# EAGLE design Mega64 (EAGLE 4.13)
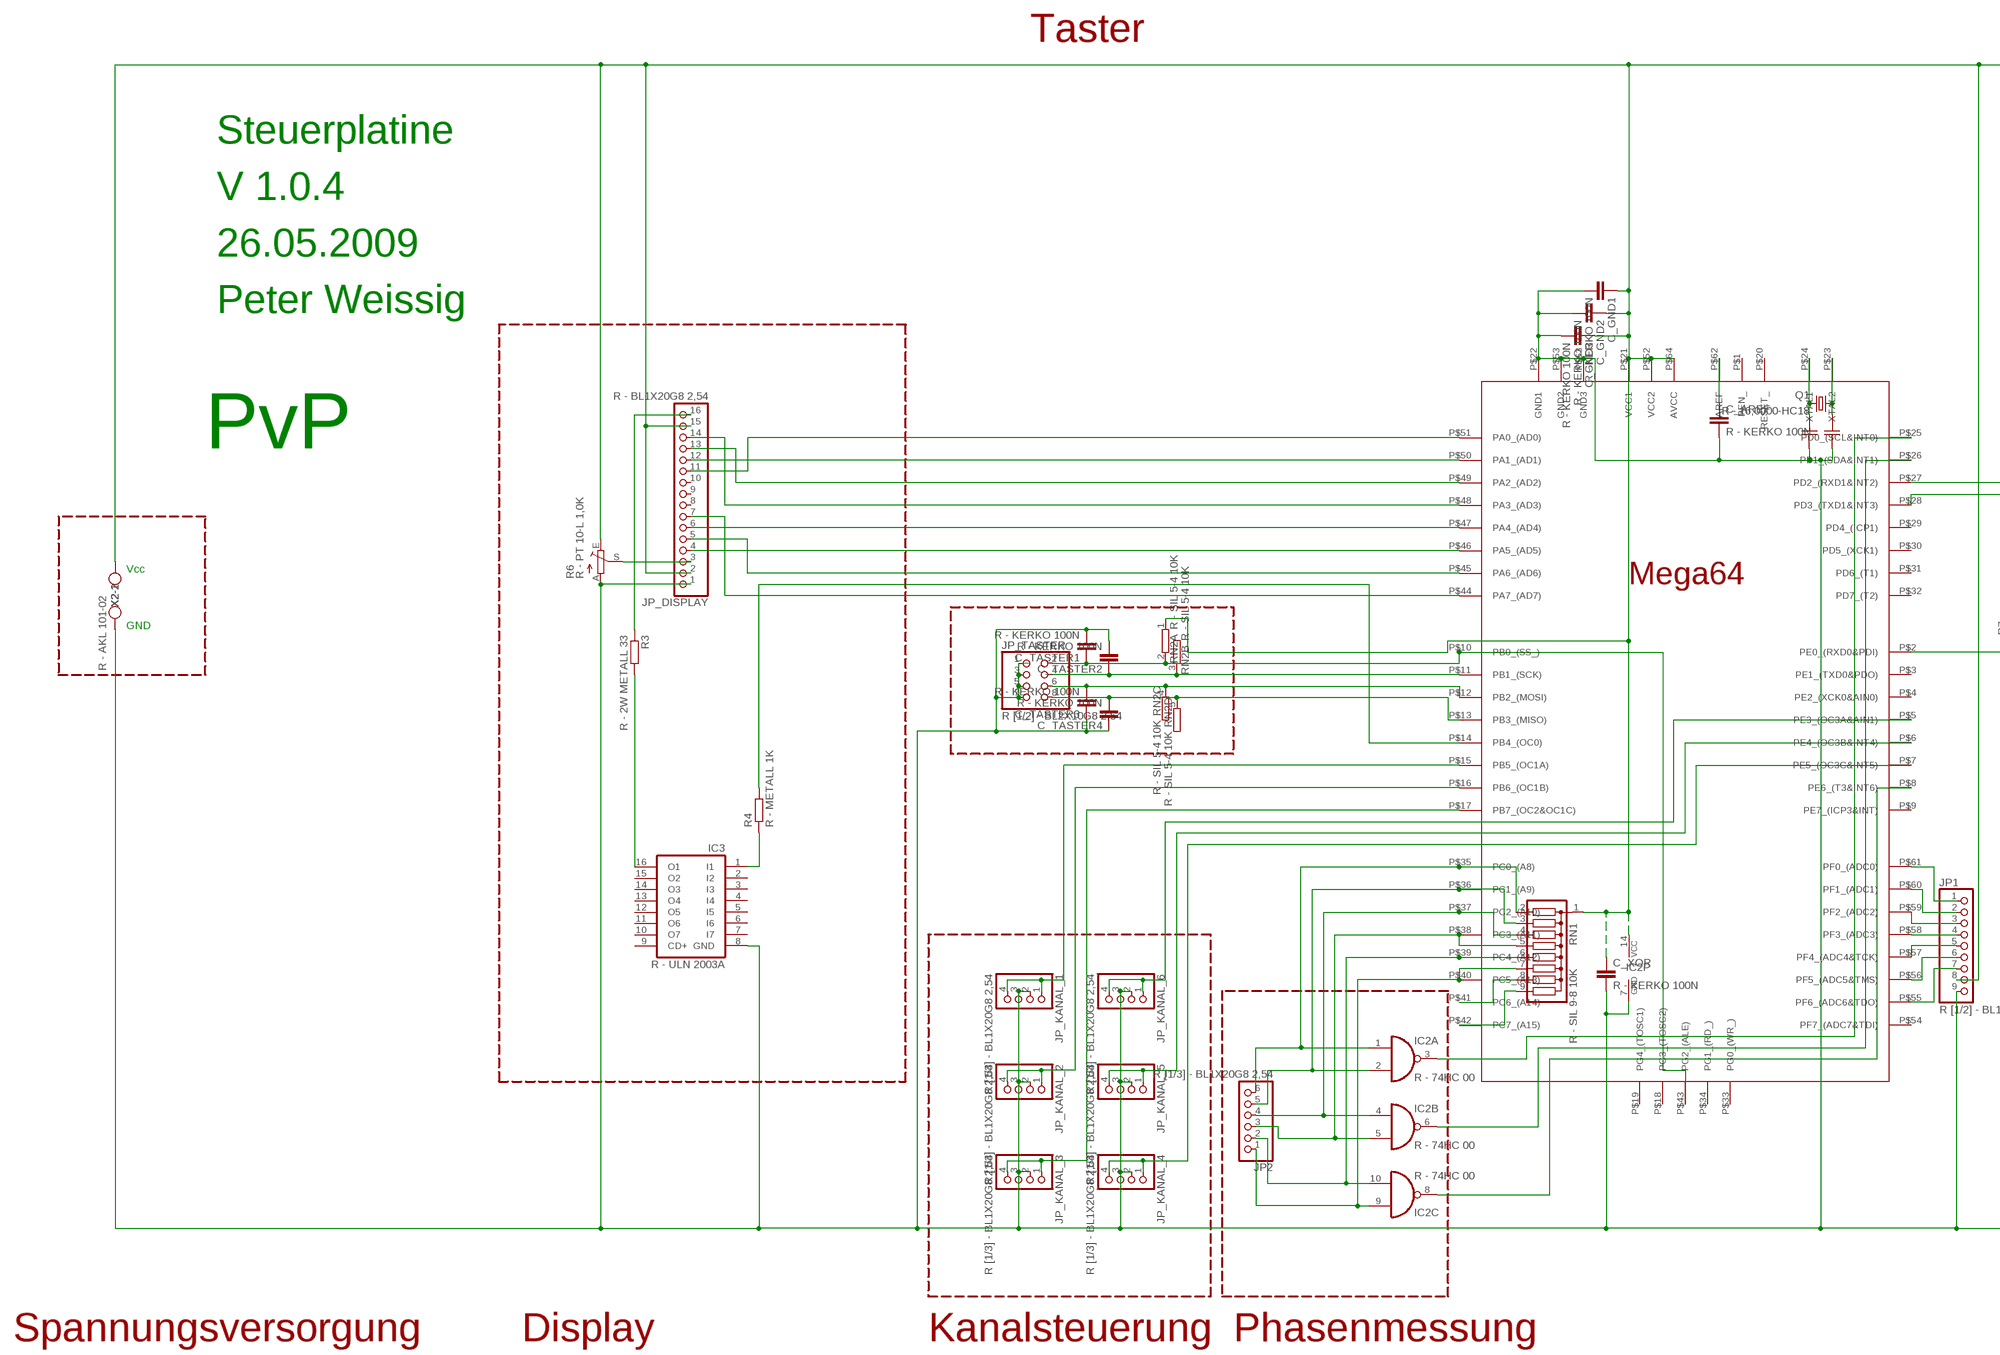
[diagram p0: schematic, sheet 1, part 1 of 2]
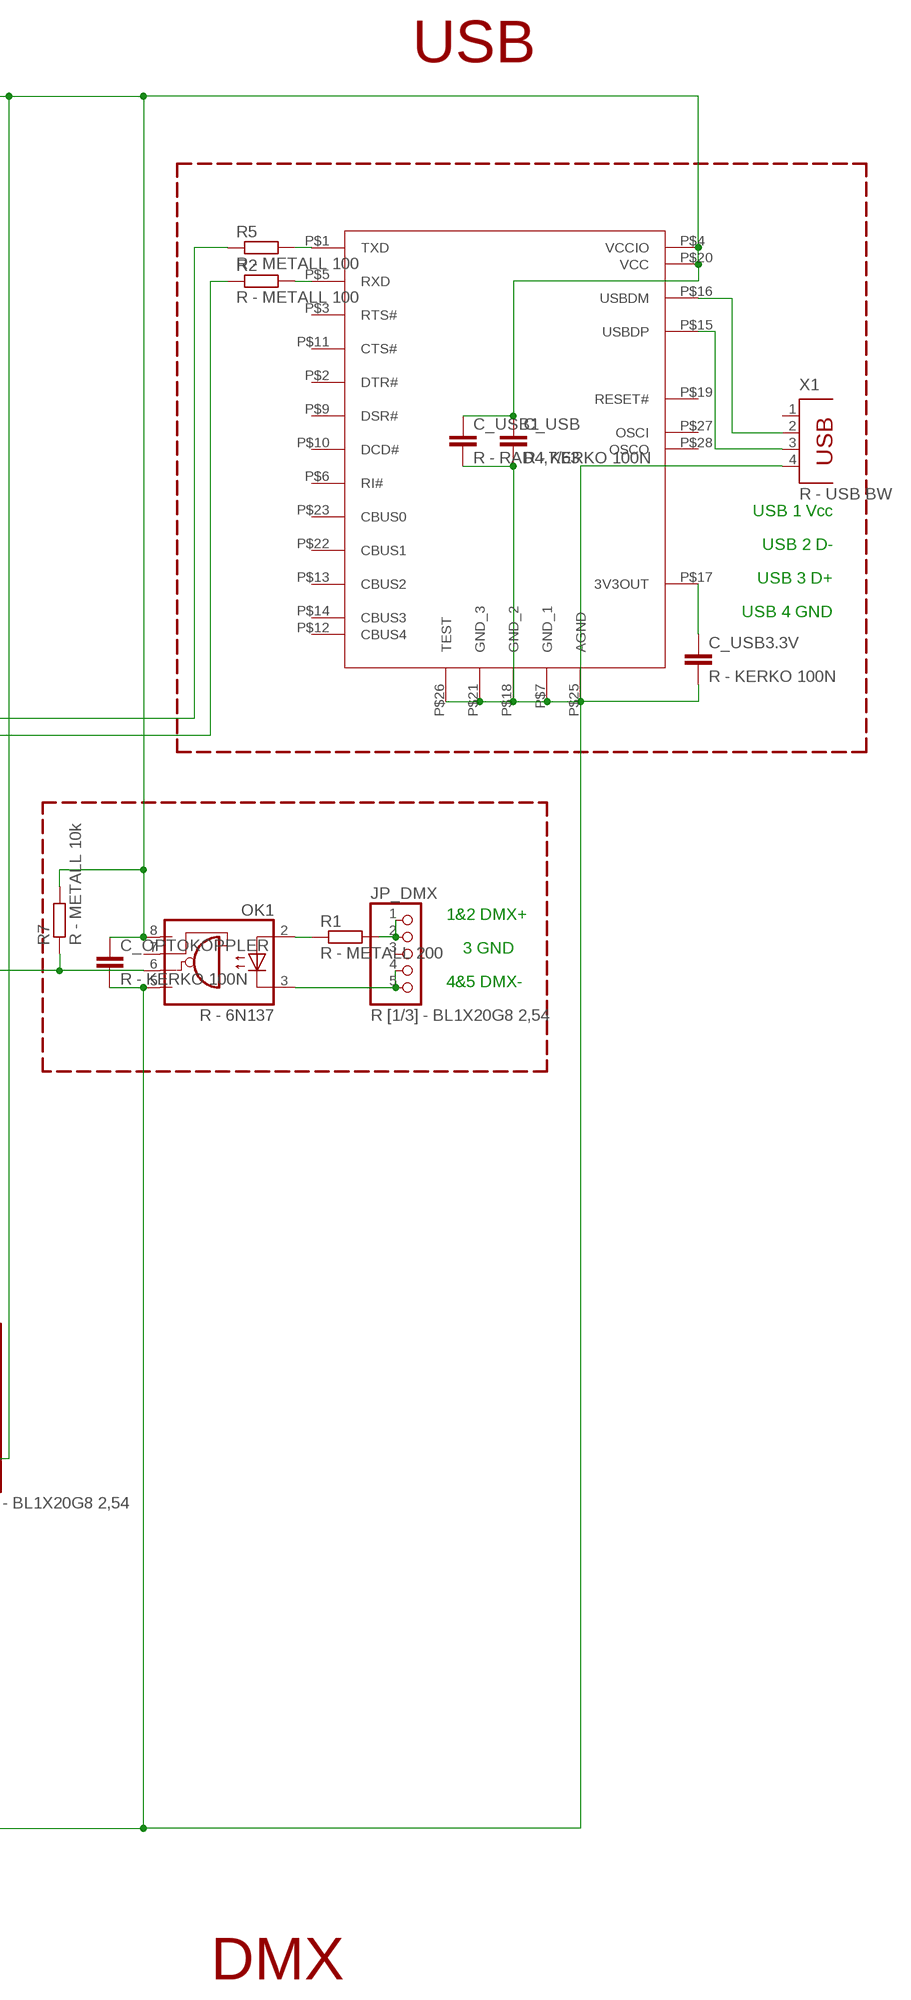
[diagram p1: schematic, sheet 1, part 2 of 2]

## Parts
C_AREF  R - KERKO 100N  C-EU025-025X050  [C025-025X050]
C_GND1  R - KERKO 100N  C-EU025-025X050  [C025-025X050]
C_GND2  R - KERKO 100N  C-EU025-025X050  [C025-025X050]
C_GND3  R - KERKO 100N  C-EU025-025X050  [C025-025X050]
C_OPTOKOPPLER  R - KERKO 100N  C-EU025-025X050  [C025-025X050]
C_TASTER1  R - KERKO 100N  C-EU050-025X075  [C050-025X075]
C_TASTER2  R - KERKO 100N  C-EU050-025X075  [C050-025X075]
C_TASTER3  R - KERKO 100N  C-EU050-025X075  [C050-025X075]
C_TASTER4  R - KERKO 100N  C-EU050-025X075  [C050-025X075]
C_USB  R - KERKO 100N  C-EU025-025X050  [C025-025X050]
C_USB1  R - RAD4,7/63  C-EU025-050X050  [C025-050X050]
C_USB3.3V  R - KERKO 100N  C-EU025-025X050  [C025-025X050]
C_XOR  R - KERKO 100N  C-EU025-025X050  [C025-025X050]
IC2  R - 74HC 00  74AC00N  [DIL14]
IC3  R - ULN 2003A  ULN2003AN  [DIL16]
JP1  R [1/2] - BL1X20G8 2,54  PINHD-1X9  [1X09]
JP2  R [1/3] - BL1X20G8 2,54  PINHD-1X6  [1X06]
JP_DISPLAY  R - BL1X20G8 2,54  PINHD-1X16  [1X16]
JP_DMX  R [1/3] - BL1X20G8 2,54  PINHD-1X5  [1X05]
JP_KANAL_1  R [1/3] - BL1X20G8 2,54  PINHD-1X4  [1X04]
JP_KANAL_2  R [1/3] - BL1X20G8 2,54  PINHD-1X4  [1X04]
JP_KANAL_3  R [1/3] - BL1X20G8 2,54  PINHD-1X4  [1X04]
JP_KANAL_4  R [1/3] - BL1X20G8 2,54  PINHD-1X4  [1X04]
JP_KANAL_5  R [1/3] - BL1X20G8 2,54  PINHD-1X4  [1X04]
JP_KANAL_6  R [1/3] - BL1X20G8 2,54  PINHD-1X4  [1X04]
JP_TASTER  R [1/2] - BL2X10G8 2,54  PINHD-2X4  [2X04]
OK1  R - 6N137  6N137  [DIL08]
Q1  R - 16,0000-HC18  CRYTALHC49U-H  [HC49U-H]
R1  R - METALL 200  R-EU_0207/10  [0207/10]
R2  R - METALL 100  R-EU_0207/10  [0207/10]
R3  R - 2W METALL 33  R-EU_0414/15  [0414/15]
R4  R - METALL 1K  R-EU_0207/10  [0207/10]
R5  R - METALL 100  R-EU_0207/10  [0207/10]
R6  R - PT 10-L 1,0K  TRIM_EU-LI10  [LI10]
R7  R - METALL 10k  R-EU_0207/10  [0207/10]
RN1  R - SIL 9-8 10K  G08R  [SIL9]
RN2  R - SIL 5-4 10K  GE04R  [SIL5]
U$1  R - ATMEGA 64-16TQ  MEGA64STECKFORM  [MEGA64_STECKFORM]
U$2  R - FT232RL  FT232RUNTEN  [SSOP28U]
U$3  R - NPO-G1206 22P  KONDENSATOR  [SMD1206]
U$4  R - NPO-G1206 22P  KONDENSATOR  [SMD1206]
X1  R - USB BW  PN61729  [PN61729]
X2  R - AKL 101-02  W237-102  [W237-102]

## Nets
AVCC: C_GND1.1 C_GND2.1 C_GND3.1 C_OPTOKOPPLER.1 C_USB1.1 C_USB.1 C_XOR.1 IC2.14(P:VCC) JP1.8 JP_DISPLAY.2 JP_DISPLAY.15 OK1.8(VCC) R6.E R7.2 RN1.1 RN2.1 U$1.P$21(VCC1) U$1.P$52(VCC2) U$1.P$64(AVCC) U$2.P$4(VCCIO) U$2.P$20(VCC) X2.1
GND: C_AREF.2 C_GND1.2 C_GND2.2 C_GND3.2 C_OPTOKOPPLER.2 C_TASTER1.2 C_TASTER2.2 C_TASTER3.1 C_TASTER4.1 C_USB1.2 C_USB3.3V.2 C_USB.2 C_XOR.2 IC2.7(P:GND) IC3.8(GND) JP1.9 JP_DISPLAY.1 JP_KANAL_1.2 JP_KANAL_1.3 JP_KANAL_2.2 JP_KANAL_2.3 JP_KANAL_3.2 JP_KANAL_3.3 JP_KANAL_4.2 JP_KANAL_4.3 JP_KANAL_5.2 JP_KANAL_5.3 JP_KANAL_6.2 JP_KANAL_6.3 JP_TASTER.1 JP_TASTER.3 JP_TASTER.5 JP_TASTER.7 OK1.5(GND) R6.A U$1.P$22(GND1) U$1.P$53(GND2) U$1.P$63(GND3) U$2.P$7(GND_1) U$2.P$18(GND_2) U$2.P$21(GND_3) U$2.P$25(AGND) U$2.P$26(TEST) U$3.P$2 U$4.P$2 X1.4 X2.2
N$1: Q1.2 U$1.P$24(XTAL1) U$3.P$1
N$2: Q1.1 U$1.P$23(XTAL2) U$4.P$1
N$3: IC2.3(A:O) U$1.P$25(PD0_(SCL&INT0))
N$4: IC2.2(A:I1) JP2.5 RN1.3 U$1.P$36(PC1_(A9))
N$5: IC2.1(A:I0) JP2.6 RN1.2 U$1.P$35(PC0_(A8))
N$6: IC2.4(B:I0) JP2.4 RN1.4 U$1.P$37(PC2_(A10))
N$7: IC2.5(B:I1) JP2.3 RN1.5 U$1.P$38(PC3_(A11))
N$8: IC2.9(C:I0) JP2.1 RN1.7 U$1.P$40(PC5_(A13))
N$9: OK1.6(VO) R7.1 U$1.P$2(PE0_(RXD0&PDI))
N$10: IC2.10(C:I1) JP2.2 RN1.6 U$1.P$39(PC4_(A12))
N$11: JP_KANAL_2.1 JP_KANAL_2.4 U$1.P$16(PB6_(OC1B))
N$12: JP_KANAL_3.1 JP_KANAL_3.4 U$1.P$17(PB7_(OC2&OC1C))
N$13: OK1.2(A) R1.1
N$14: JP_DMX.4 JP_DMX.5 OK1.3(C)
N$15: JP_KANAL_6.1 JP_KANAL_6.4 U$1.P$5(PE3_(OC3A&AIN1))
N$16: JP_KANAL_5.1 JP_KANAL_5.4 U$1.P$6(PE4_(OC3B&INT4))
N$17: JP_KANAL_4.1 JP_KANAL_4.4 U$1.P$7(PE5_(OC3C&INT5))
N$18: JP_DMX.1 JP_DMX.2 R1.2
N$19: JP_DISPLAY.5 U$1.P$45(PA6_(AD6))
N$20: JP_DISPLAY.4 U$1.P$46(PA5_(AD5))
N$21: JP_DISPLAY.6 U$1.P$47(PA4_(AD4))
N$22: JP_DISPLAY.14 U$1.P$48(PA3_(AD3))
N$23: JP_DISPLAY.13 U$1.P$49(PA2_(AD2))
N$24: JP_DISPLAY.12 U$1.P$50(PA1_(AD1))
N$25: JP_DISPLAY.11 U$1.P$51(PA0_(AD0))
N$26: JP_DISPLAY.16 R3.1
N$27: R4.2 U$1.P$14(PB4_(OC0))
N$28: JP_DISPLAY.3 R6.S
N$29: JP1.1 U$1.P$61(PF0_(ADC0))
N$30: IC2.6(B:O) U$1.P$26(PD1_(SDA&INT1))
N$31: JP1.2 U$1.P$60(PF1_(ADC1))
N$32: JP1.4 U$1.P$58(PF3_(ADC3))
N$33: JP1.3 U$1.P$59(PF2_(ADC2))
N$34: JP1.5 U$1.P$57(PF4_(ADC4&TCK))
N$35: JP1.6 U$1.P$56(PF5_(ADC5&TMS))
N$36: JP1.7 U$1.P$55(PF6_(ADC6&TDO))
N$37: U$2.P$16(USBDM) X1.2
N$38: U$2.P$15(USBDP) X1.3
N$39: C_TASTER1.1 JP_TASTER.2 RN2.2 U$1.P$10(PB0_(SS_)) U$1.P$43(PG2_(ALE))
N$41: IC3.16(O1) R3.2
N$42: IC2.8(C:O) U$1.P$8(PE6_(T3&INT6))
N$43: RN1.8 U$1.P$41(PC6_(A14))
N$44: JP_KANAL_1.1 JP_KANAL_1.4 U$1.P$15(PB5_(OC1A))
N$45: RN1.9 U$1.P$42(PC7_(A15))
N$46: IC3.1(I1) R4.1
N$47: R5.2 U$2.P$1(TXD)
N$48: R5.1 U$1.P$27(PD2_(RXD1&INT2))
N$49: R2.1 U$1.P$28(PD3_(TXD1&INT3))
N$50: C_TASTER3.2 JP_TASTER.6 RN2.4 U$1.P$12(PB2_(MOSI))
N$51: R2.2 U$2.P$5(RXD)
N$52: C_TASTER2.1 JP_TASTER.4 RN2.3 U$1.P$11(PB1_(SCK))
N$53: C_TASTER4.2 JP_TASTER.8 RN2.5 U$1.P$13(PB3_(MISO))
N$54: C_USB3.3V.1 U$2.P$17(3V3OUT)
N$55: JP_DISPLAY.7 U$1.P$44(PA7_(AD7))
N$63: C_AREF.1 U$1.P$62(AREF)
Unconnected: IC2.11(D:O) IC2.12(D:I0) IC2.13(D:I1) IC3.2(I2) IC3.3(I3) IC3.4(I4) IC3.5(I5) IC3.6(I6) IC3.7(I7) IC3.9(CD+) IC3.10(O7) IC3.11(O6) IC3.12(O5) IC3.13(O4) IC3.14(O3) IC3.15(O2) JP_DISPLAY.8 JP_DISPLAY.9 JP_DISPLAY.10 JP_DMX.3 OK1.7(VE) U$1.P$1(PEN_) U$1.P$3(PE1_(TXD0&PDO)) U$1.P$4(PE2_(XCK0&AIN0)) U$1.P$9(PE7_(ICP3&INT)) U$1.P$18(PG3_(TOSC2)) U$1.P$19(PG4_(TOSC1)) U$1.P$20(RESET_) U$1.P$29(PD4_(ICP1)) U$1.P$30(PD5_(XCK1)) U$1.P$31(PD6_(T1)) U$1.P$32(PD7_(T2)) U$1.P$33(PG0_(WR_)) U$1.P$34(PG1_(RD_)) U$1.P$54(PF7_(ADC7&TDI)) U$2.P$2(DTR#) U$2.P$3(RTS#) U$2.P$6(RI#) U$2.P$9(DSR#) U$2.P$10(DCD#) U$2.P$11(CTS#) U$2.P$12(CBUS4) U$2.P$13(CBUS2) U$2.P$14(CBUS3) U$2.P$19(RESET#) U$2.P$22(CBUS1) U$2.P$23(CBUS0) U$2.P$27(OSCI) U$2.P$28(OSCO) X1.1

## Notes on the sheet
- Taster | USB
- Steuerplatine
- V 1.0.4
- 26.05.2009
- Peter Weissig
- USB 1 Vcc
- USB 2 D-
- USB 3 D+
- USB 4 GND
- PvP
- Vcc
- 1&2 DMX+
- GND
- 3 GND
- 4&5 DMX-
- Spannungsversorgung | Display | Kanalsteuerung | Phasenmessung | DMX

## Library data of the parts
C_AREF C_GND1-C_GND3 C_OPTOKOPPLER C_TASTER1-C_TASTER4 C_USB C_USB1 C_USB3.3V C_XOR = rcl:C-EU: CAPACITOR, European symbol
IC2 = 74xx-eu:74*00: Quad 2-input NAND gate
IC3 = uln-udn:ULN2003A: DRIVER ARRAY
JP1 = pinhead:PINHD-1X9: PIN HEADER
JP2 = pinhead:PINHD-1X6: PIN HEADER
JP_DISPLAY = pinhead:PINHD-1X16: PIN HEADER
JP_DMX = pinhead:PINHD-1X5: PIN HEADER
JP_KANAL_1-JP_KANAL_6 = pinhead:PINHD-1X4: PIN HEADER
JP_TASTER = pinhead:PINHD-2X4: PIN HEADER
OK1 = optocoupler:6N137: MOTOROLA OPTO COUPLER
Q1 = crystal:CRYTAL: CRYSTAL
R1-R5 R7 = rcl:R-EU_: RESISTOR, European symbol
R6 = pot:TRIM_EU-: POTENTIOMETER
RN1 = resistor-sil:G08R: SIL RESISTOR
RN2 = resistor-sil:GE04R: SIL RESISTOR
U$1 = Meine eigene:MEGA64
U$2 = Meine eigene:FT232R
U$3 U$4 = Meine eigene:KONDENSATOR
X1 = con-berg:PN61729: BERG USB connector
X2 = con-wago-500:W237-102: WAGO SCREW CLAMP

## Board
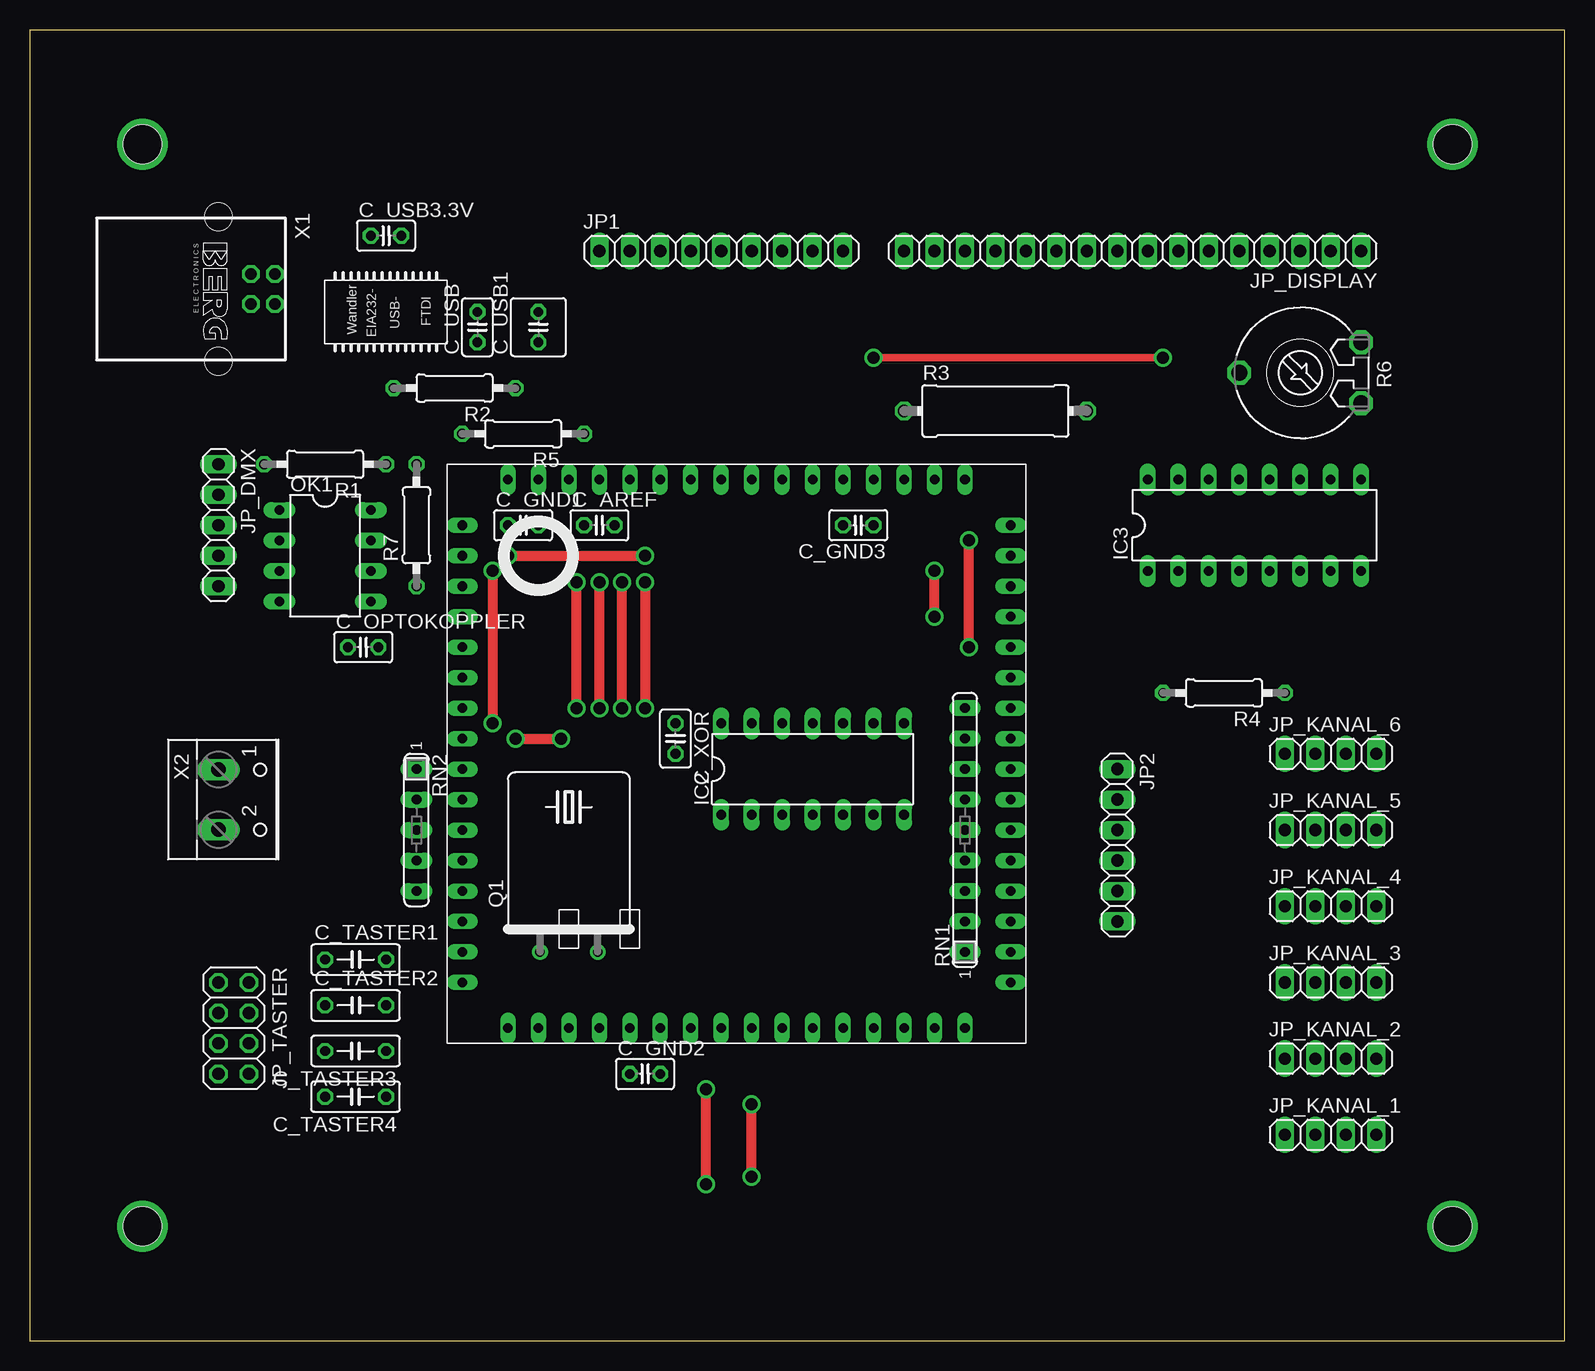
[diagram p2: board, top side]
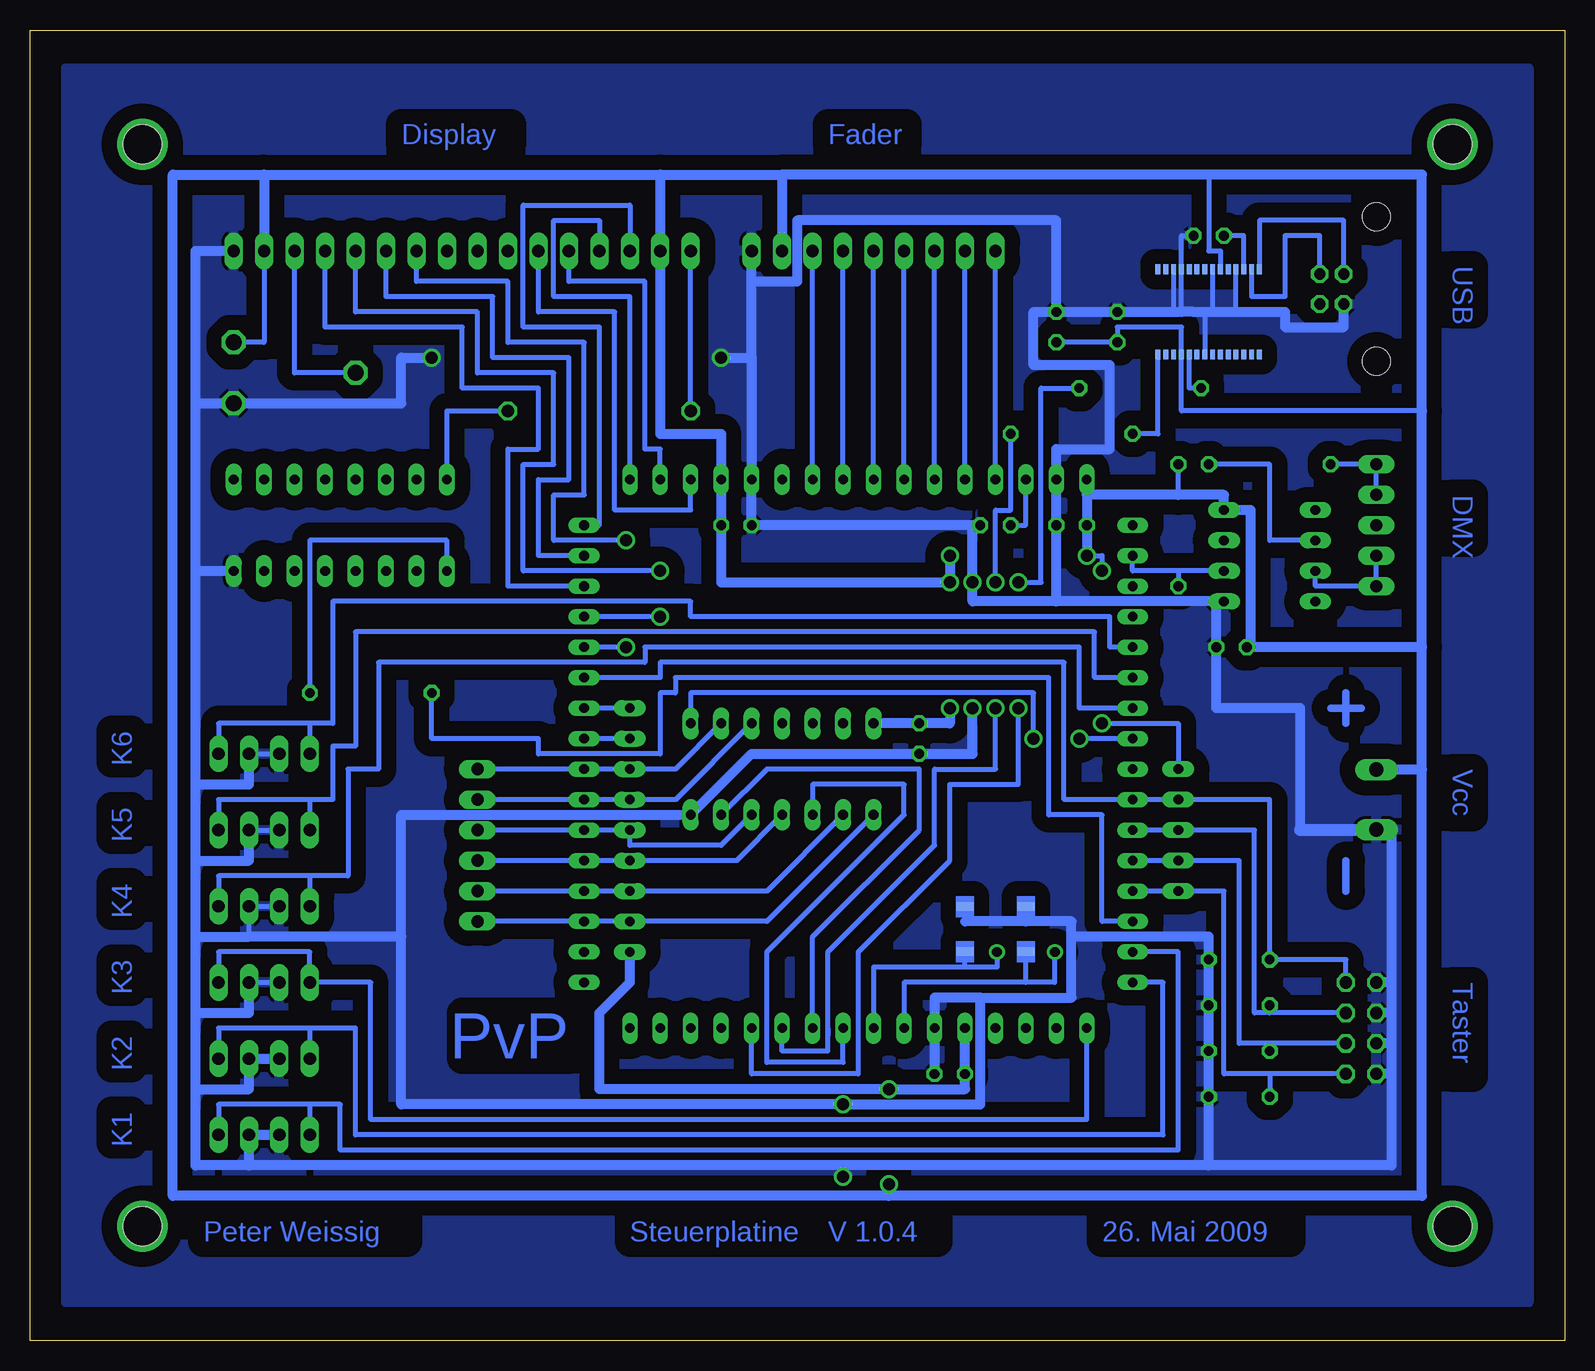
[diagram p3: board, bottom side, seen from below]

Size 127.94 x 109.21 mm. Coordinates in mm from the lower left corner, seen from the top.
Outline: 0,0 127.94,0 127.94,109.21 0,109.21 0,0
Copper layers (1*16): Top 0.035mm / dielectric 1.5mm / Bottom 0.035mm
Design rules "default": minimum track width 10mil, minimum drill 24mil, track to track 8mil, track to pad 8mil, pad to pad 8mil, via to via 8mil, smd to smd 8mil, copper to edge 40mil, drill to drill 8mil, minimum pad ring 10mil, minimum via ring 8mil, stop-mask expansion 4mil, vias tented up to drill 0mil, thermal gap 10mil
Holes 3.2 mm at 9.36,99.69 118.58,99.69 118.58,9.52 9.36,9.52

### Footprints (pad centres in the part's own frame; a part is rotated, then mirrored left to right if it is on the bottom)
C025-025X050 = drill 0.813 octagon: 1 -1.27,0; 2 1.27,0
C050-025X075 = drill 0.813 octagon: 1 -2.54,0; 2 2.54,0
C025-050X050 = drill 0.813 octagon: 1 -1.27,0; 2 1.27,0
DIL14 = drill 0.813 long: 1 -7.62,-3.81; 2 -5.08,-3.81; 3 -2.54,-3.81; 4 0,-3.81; 5 2.54,-3.81; 6 5.08,-3.81; 7 7.62,-3.81; 8 7.62,3.81; 9 5.08,3.81; 10 2.54,3.81; 11 0,3.81; 12 -2.54,3.81; 13 -5.08,3.81; 14 -7.62,3.81
DIL16 = drill 0.813 long: 1 -8.89,-3.81; 2 -6.35,-3.81; 3 -3.81,-3.81; 4 -1.27,-3.81; 5 1.27,-3.81; 6 3.81,-3.81; 7 6.35,-3.81; 8 8.89,-3.81; 9 8.89,3.81; 10 6.35,3.81; 11 3.81,3.81; 12 1.27,3.81; 13 -1.27,3.81; 14 -3.81,3.81; 15 -6.35,3.81; 16 -8.89,3.81
1X09 = drill 1.016 long: 1 -10.16,0; 2 -7.62,0; 3 -5.08,0; 4 -2.54,0; 5 0,0; 6 2.54,0; 7 5.08,0; 8 7.62,0; 9 10.16,0
1X06 = drill 1.016 long: 1 -6.35,0; 2 -3.81,0; 3 -1.27,0; 4 1.27,0; 5 3.81,0; 6 6.35,0
1X16 = drill 1.016 long: 1 -19.05,0; 2 -16.51,0; 3 -13.97,0; 4 -11.43,0; 5 -8.89,0; 6 -6.35,0; 7 -3.81,0; 8 -1.27,0; 9 1.27,0; 10 3.81,0; 11 6.35,0; 12 8.89,0; 13 11.43,0; 14 13.97,0; 15 16.51,0; 16 19.05,0
1X05 = drill 1.016 long: 1 -5.08,0; 2 -2.54,0; 3 0,0; 4 2.54,0; 5 5.08,0
1X04 = drill 1.016 long: 1 -3.81,0; 2 -1.27,0; 3 1.27,0; 4 3.81,0
2X04 = drill 1.016 octagon: 1 -3.81,-1.27; 2 -3.81,1.27; 3 -1.27,-1.27; 4 -1.27,1.27; 5 1.27,-1.27; 6 1.27,1.27; 7 3.81,-1.27; 8 3.81,1.27
DIL08 = drill 0.813 long: 1 -3.81,-3.81; 2 -1.27,-3.81; 3 1.27,-3.81; 4 3.81,-3.81; 5 3.81,3.81; 6 1.27,3.81; 7 -1.27,3.81; 8 -3.81,3.81
HC49U-H = drill 0.813 round: 1 -2.413,-5.08; 2 2.413,-5.08
0207/10 = drill 0.813 octagon: 1 -5.08,0; 2 5.08,0
0414/15 = drill 1.016 octagon: 1 -7.62,0; 2 7.62,0
LI10 = drill 1.321 octagon: A -2.54,-5.08; E 2.54,-5.08; S 0,5.08
SIL9 = drill 0.813 long: 1 -10.16,0; 2 -7.62,0; 3 -5.08,0; 4 -2.54,0; 5 0,0; 6 2.54,0; 7 5.08,0; 8 7.62,0; 9 10.16,0
SIL5 = drill 0.813 long: 1 -5.08,0; 2 -2.54,0; 3 0,0; 4 2.54,0; 5 5.08,0
MEGA64_STECKFORM = drill 0.8 long: P$1 -22.86,19.05; P$2 -22.86,16.51; P$3 -22.86,13.97; P$4 -22.86,11.43; P$5 -22.86,8.89; P$6 -22.86,6.35; P$7 -22.86,3.81; P$8 -22.86,1.27; P$9 -22.86,-1.27; P$10 -22.86,-3.81; P$11 -22.86,-6.35; P$12 -22.86,-8.89; P$13 -22.86,-11.43; P$14 -22.86,-13.97; P$15 -22.86,-16.51; P$16 -22.86,-19.05; P$17 -19.05,-22.86; P$18 -16.51,-22.86; P$19 -13.97,-22.86; P$20 -11.43,-22.86; P$21 -8.89,-22.86; P$22 -6.35,-22.86; P$23 -3.81,-22.86; P$24 -1.27,-22.86; P$25 1.27,-22.86; P$26 3.81,-22.86; P$27 6.35,-22.86; P$28 8.89,-22.86; P$29 11.43,-22.86; P$30 13.97,-22.86; P$31 16.51,-22.86; P$32 19.05,-22.86; P$33 22.86,-19.05; P$34 22.86,-16.51; P$35 22.86,-13.97; P$36 22.86,-11.43; P$37 22.86,-8.89; P$38 22.86,-6.35; P$39 22.86,-3.81; P$40 22.86,-1.27; P$41 22.86,1.27; P$42 22.86,3.81; P$43 22.86,6.35; P$44 22.86,8.89; P$45 22.86,11.43; P$46 22.86,13.97; P$47 22.86,16.51; P$48 22.86,19.05; P$49 19.05,22.86; P$50 16.51,22.86; P$51 13.97,22.86; P$52 11.43,22.86; P$53 8.89,22.86; P$54 6.35,22.86; P$55 3.81,22.86; P$56 1.27,22.86; P$57 -1.27,22.86; P$58 -3.81,22.86; P$59 -6.35,22.86; P$60 -8.89,22.86; P$61 -11.43,22.86; P$62 -13.97,22.86; P$63 -16.51,22.86; P$64 -19.05,22.86
SSOP28U = smd 0.813 x 0.406 bottom: P$1 3.55,4.225; P$2 3.55,3.575; P$3 3.55,2.925; P$4 3.55,2.275; P$5 3.55,1.625; P$6 3.55,0.975; P$7 3.55,0.325; P$8 3.55,-0.325; P$9 3.55,-0.975; P$10 3.55,-1.625; P$11 3.55,-2.275; P$12 3.55,-2.925; P$13 3.55,-3.575; P$14 3.55,-4.225; P$15 -3.55,-4.225; P$16 -3.55,-3.575; P$17 -3.55,-2.925; P$18 -3.55,-2.275; P$19 -3.55,-1.625; P$20 -3.55,-0.975; P$21 -3.55,-0.325; P$22 -3.55,0.325; P$23 -3.55,0.975; P$24 -3.55,1.625; P$25 -3.55,2.275; P$26 -3.55,2.925; P$27 -3.55,3.575; P$28 -3.55,4.225
SMD1206 = smd 1.422 x 0.711 bottom: P$1 0,-1.875; P$2 0,1.875
PN61729 = drill 0.95 octagon: 1 1.25,4.71; 2 -1.25,4.71; 3 -1.25,2.71; 4 1.25,2.71 | hole 2.3: -6.02,0; 6.02,0
W237-102 = drill 1.194 long: 1 -2.5,-1.27; 2 2.5,-1.27

### Placement (x,y rotation side)
C_AREF  47.46,67.94 0 top
C_GND1  41.11,67.94 0 top
C_GND2  51.27,22.22 0 top
C_GND3  69.05,67.94 180 top
C_OPTOKOPPLER  27.77,57.78 0 top
C_TASTER1  27.14,31.74 0 top
C_TASTER2  27.14,27.93 0 top
C_TASTER3  27.14,24.12 180 top
C_TASTER4  27.14,20.31 180 top
C_USB  37.3,84.45 90 top
C_USB1  42.38,84.45 90 top
C_USB3.3V  29.68,92.07 0 top
C_XOR  53.81,50.16 270 top
IC2  65.24,47.62 0 top
IC3  102.07,67.94 0 top
JP1  57.62,90.8 0 top
JP2  90.64,41.27 270 top
JP_DISPLAY  91.91,90.8 180 top
JP_DMX  15.71,67.94 270 top
JP_KANAL_1  108.42,17.14 0 top
JP_KANAL_2  108.42,23.49 0 top
JP_KANAL_3  108.42,29.84 0 top
JP_KANAL_4  108.42,36.19 0 top
JP_KANAL_5  108.42,42.54 0 top
JP_KANAL_6  108.42,48.89 0 top
JP_TASTER  16.98,26.03 270 top
OK1  24.6,65.4 270 top
Q1  44.92,37.46 0 top
R1  24.6,73.02 180 top
R2  35.39,79.37 180 top
R3  80.48,77.47 0 top
R4  99.53,53.97 180 top
R5  41.11,75.56 180 top
R6  105.88,80.64 90 top
R7  32.22,67.94 90 top
RN1  77.94,42.54 90 top
RN2  32.22,42.54 270 top
U$1  58.89,48.89 0 top
U$2  29.68,85.72 270 top
U$3  50,34.28 0 top
U$4  44.92,34.28 0 top
X1  15.71,87.62 270 top
X2  16.98,45.08 270 top

### Tracks (layer width: path | path; a pad name or v marks a point on that pad's centre or on a via)
AVCC  (via drill 1)
  Top 0.813: v51.27,63.18 v51.27,52.7 | v39.84,65.4 v51.27,65.4 | v56.35,13.01 v56.35,20.95 | v38.57,64.13 v38.57,51.43
  Bottom 0.406: JP_DISPLAY.2 108.42,83.18 R6.E | C_USB1.1 C_USB.1 37.3,84.45 31.95,84.45 U$2.P$4 31.95,77.47 11.9,77.47 | U$2.P$20 28.7,90.8 29.68,90.8 29.68,97.15 | RN2.1 32.22,51.43 v38.57,51.43 | v38.57,64.13 38.57,65.4 v39.84,65.4 | 32.22,70.48 R7.2
  Bottom 0.813: 26.19,57.78 26.19,69.21 OK1.8 28.41,70.48 32.22,70.48 39.84,70.48 | U$1.P$21 C_GND2.1 50,20.95 v56.35,20.95 80.48,20.95 80.48,27.3 77.94,29.84 RN1.1 | 39.84,70.48 C_GND1.1 v39.84,65.4 | 39.84,70.48 U$1.P$64 | IC2.14 C_XOR.1 51.27,51.43 v51.27,52.7 | v51.27,65.4 v51.27,63.18 70.32,63.18 C_GND3.1 U$1.P$52 70.32,75.56 75.4,75.56 JP_DISPLAY.15 75.4,97.15 | 108.42,97.15 116.04,97.15 116.04,12.06 56.35,12.06 | 108.42,97.15 75.4,97.15 | 65.24,97.15 29.68,97.15 11.9,97.15 11.9,77.47 11.9,57.78 | 75.4,97.15 65.24,97.15 | 11.9,57.78 26.19,57.78 | 26.19,57.78 C_OPTOKOPPLER.1 | 108.42,97.15 JP_DISPLAY.2 | 65.24,97.15 JP1.8 | 11.9,47.58 X2.1 | 11.9,47.58 11.9,57.78 | 11.9,47.58 11.9,12.06 56.35,12.06 | 56.35,12.06 v56.35,13.01
GND  (via drill 1)
  Top 0.61: v94.45,81.91 v70.32,81.91
  Top 0.813: v49.36,52.7 v49.36,63.18 | v60.16,13.65 v60.16,19.68
  Bottom 0.406: JP_KANAL_6.3 JP_KANAL_6.2 | JP_KANAL_5.3 JP_KANAL_5.2 | JP_KANAL_4.2 JP_KANAL_4.3 109.69,33.65 | JP_KANAL_3.3 JP_KANAL_3.2 | U$2.P$7 30,85.72 29.68,85.72 29.35,85.72 U$2.P$21 | U$2.P$26 32.6,85.72 32.22,85.72 30.95,85.72 | 31.95,85.72 U$2.P$25 31.95,92.07 C_USB3.3V.2 | U$2.P$18 27.41,85.72 28.41,85.72 | 44.92,34.92 U$4.P$2 | 50,34.92 U$3.P$2 | 50,67.94 C_AREF.2
  Bottom 0.813: 29.05,61.59 C_OPTOKOPPLER.2 29.05,52.7 22.06,52.7 22.06,42.54 | C_GND2.2 U$1.P$22 52.54,28.57 48.73,28.57 | X1.4 18.42,84.45 23.33,84.45 23.33,85.72 28.41,85.72 29.68,85.72 30.95,85.72 31.95,85.72 | 67.78,88.26 JP1.9 | JP_KANAL_1.2 JP_KANAL_1.3 109.69,14.6 | JP_KANAL_2.2 JP_KANAL_2.3 109.69,20.95 114.13,20.95 | 29.05,61.59 OK1.5 | 29.05,61.59 42.38,61.59 | 42.38,61.59 C_GND1.2 U$1.P$63 42.38,74.29 37.94,74.29 37.94,81.28 44.28,81.28 44.28,85.72 C_USB1.2 | JP_KANAL_5.3 109.69,40 114.13,40 | JP_KANAL_6.3 109.69,46.35 114.13,46.35 | JP_KANAL_3.3 109.69,27.3 114.13,27.3 | 114.13,20.95 114.13,14.6 109.69,14.6 | 114.13,20.95 114.13,27.3 | 114.13,27.3 114.13,33.65 | 114.13,33.65 114.13,40 | 114.13,40 114.13,46.35 | 114.13,33.65 109.69,33.65 96.99,33.65 | 96.99,33.65 96.99,43.81 IC2.7 67.78,48.89 C_XOR.2 49.36,48.89 v49.36,52.7 | 48.73,28.57 48.73,19.68 v60.16,19.68 96.99,19.68 96.99,33.65 | 48.73,28.57 41.11,28.57 41.11,33.65 | 41.11,33.65 41.11,34.92 44.92,34.92 50,34.92 | 42.38,61.59 49.36,61.59 v49.36,63.18 49.36,67.94 50,67.94 C_GND3.2 U$1.P$53 67.78,81.91 | 29.68,14.6 14.44,14.6 14.44,22.22 | 14.44,22.22 14.44,24.76 | 14.44,24.76 14.44,27.3 | 14.44,27.3 14.44,29.84 | 14.44,29.84 14.44,42.54 | 14.44,29.84 JP_TASTER.1 | 14.44,27.3 JP_TASTER.3 | 14.44,24.76 JP_TASTER.5 | 14.44,22.22 JP_TASTER.7 | 29.68,14.6 C_TASTER4.1 C_TASTER3.1 C_TASTER2.2 C_TASTER1.2 29.68,33.65 41.11,33.65 | C_USB1.2 C_USB.2 32.22,85.72 | C_USB1.2 42.38,93.34 63.97,93.34 63.97,88.26 67.78,88.26 | v94.45,81.91 96.99,81.91 96.99,78.1 R6.A 114.13,78.1 | 67.78,81.91 67.78,88.26 | v70.32,81.91 67.78,81.91 | 114.13,46.35 114.13,64.13
  Bottom 0.813: 114.13,64.13 IC3.8 | 114.13,64.13 114.13,78.1 | 114.13,78.1 114.13,90.8 JP_DISPLAY.1 | 29.68,14.6 60.16,14.6 | 60.16,14.6 109.69,14.6 | 60.16,14.6 v60.16,13.65
  Bottom 1.016: 14.44,42.54 22.06,42.54
  pour Bottom (isolate 1.27): 3.01,106.04 3.01,3.17 124.93,3.17 124.93,106.04
N$1
  Bottom 0.406: Q1.2 47.33,31.11 50,31.11 | 50,31.11 57.62,31.11 U$1.P$24 | U$3.P$1 50,32.38 50,31.11
N$2
  Bottom 0.406: Q1.1 42.51,29.84 44.92,29.84 | 44.92,29.84 55.08,29.84 U$1.P$23 | U$4.P$1 44.92,32.38 44.92,31.11 44.92,29.84
N$3
  Bottom 0.406: IC2.3 62.7,46.35 55.08,46.35 55.08,43.81 66.51,32.38 66.51,23.17 60.16,23.17 U$1.P$25
N$4
  Bottom 0.406: IC2.2 66.51,37.46 RN1.3 U$1.P$36 88.1,37.46 JP2.5
N$5
  Bottom 0.406: IC2.1 66.51,34.92 RN1.2 U$1.P$35 JP2.6
N$6
  Bottom 0.406: IC2.4 69.05,40 RN1.4 U$1.P$37 JP2.4
N$7
  Bottom 0.406: IC2.5 70.32,41.27 77.94,41.27 RN1.5 U$1.P$38 JP2.3
N$8
  Bottom 0.406: IC2.9 74.13,47.62 RN1.7 U$1.P$40 88.1,47.62 JP2.1
N$9
  Bottom 0.406: 32.22,64.13 36.03,64.13 U$1.P$2 | OK1.6 32.22,64.13 | 32.22,64.13 R7.1
N$10
  Bottom 0.406: IC2.10 74.13,45.08 RN1.6 U$1.P$39 JP2.2
N$11
  Bottom 0.406: JP_KANAL_2.4 112.23,26.03 104.61,26.03 | 104.61,26.03 JP_KANAL_2.1 | 104.61,26.03 100.8,26.03 100.8,17.14 33.49,17.14 33.49,29.84 U$1.P$16
N$12
  Bottom 0.406: JP_KANAL_3.4 112.23,32.38 104.61,32.38 JP_KANAL_3.1 99.53,29.84 99.53,18.41 39.84,18.41 U$1.P$17
N$13
  Bottom 0.406: R1.1 24.6,73.02 24.6,66.67 OK1.2
N$14
  Bottom 0.406: JP_DMX.4 JP_DMX.5 20.79,62.86 OK1.3
N$15
  Bottom 0.406: U$1.P$5 37.94,57.78 37.94,60.32 72.86,60.32 72.86,61.59 102.7,61.59 102.7,51.43 104.61,51.43 | JP_KANAL_6.4 112.23,51.43 104.61,51.43 | 104.61,51.43 JP_KANAL_6.1
N$16
  Bottom 0.406: JP_KANAL_5.4 112.23,45.08 104.61,45.08 | 104.61,45.08 JP_KANAL_5.1 | U$1.P$6 39.2,55.24 39.2,59.05 100.8,59.05 100.8,49.52 102.7,49.52 102.7,45.08 104.61,45.08
N$17
  Bottom 0.406: JP_KANAL_4.4 112.23,38.73 104.61,38.73 | 104.61,38.73 JP_KANAL_4.1 | 104.61,38.73 101.44,38.73 101.44,47.62 98.89,47.62 98.89,56.51 76.67,56.51 76.67,57.78 40.48,57.78 40.48,52.7 U$1.P$7
N$18
  Bottom 0.406: JP_DMX.2 JP_DMX.1 R1.2
N$19  (via drill 1)
  Top 0.813: v75.4,60.32 v75.4,64.13
  Bottom 0.406: v75.4,60.32 U$1.P$45 | v75.4,64.13 86.83,64.13 86.83,73.02 84.29,73.02 84.29,80.64 90.64,80.64 90.64,85.72 100.8,85.72 JP_DISPLAY.5
N$20
  Bottom 0.406: U$1.P$46 88.1,62.86 88.1,74.29 85.56,74.29 85.56,79.37 91.91,79.37 91.91,84.45 103.34,84.45 JP_DISPLAY.4
N$21
  Bottom 0.406: U$1.P$47 85.56,65.4 85.56,71.75 83.02,71.75 83.02,81.91 89.37,81.91 89.37,86.99 98.26,86.99 JP_DISPLAY.6
N$22
  Bottom 0.406: JP_DISPLAY.14 77.94,94.61 86.83,94.61 86.83,84.45 80.48,84.45 80.48,67.94 U$1.P$48
N$23
  Bottom 0.406: U$1.P$49 77.94,86.99 84.29,86.99 84.29,93.34 80.48,93.34 JP_DISPLAY.13
N$24
  Bottom 0.406: U$1.P$50 75.4,74.29 76.67,74.29 76.67,88.26 83.02,88.26 JP_DISPLAY.12
N$25
  Bottom 0.406: U$1.P$51 72.86,69.21 79.21,69.21 79.21,85.72 85.56,85.72 JP_DISPLAY.11
N$26
  Bottom 0.406: R3.1 JP_DISPLAY.16
N$27
  Bottom 0.406: R4.2 94.45,50.16 85.56,50.16 85.56,48.89 75.4,48.89 75.4,53.97 74.13,53.97 74.13,55.24 43.02,55.24 43.02,43.81 38.57,43.81 38.57,34.92 U$1.P$14
N$28
  Bottom 0.406: JP_DISPLAY.3 105.88,80.64 R6.S
N$29
  Bottom 0.406: U$1.P$61 JP1.1
N$30
  Bottom 0.406: IC2.6 66.51,47.62 53.81,47.62 53.81,42.54 62.7,33.65 U$1.P$26
N$31
  Bottom 0.406: U$1.P$60 JP1.2
N$32
  Bottom 0.406: U$1.P$58 JP1.4
N$33
  Bottom 0.406: U$1.P$59 JP1.3
N$34
  Bottom 0.406: U$1.P$57 JP1.5
N$35
  Bottom 0.406: U$1.P$56 JP1.6
N$36
  Bottom 0.406: U$1.P$55 JP1.7
N$37
  Bottom 0.406: X1.2 20.42,92.07 23.33,92.07 23.33,86.99 26.1,86.99 U$2.P$16
N$38
  Bottom 0.406: X1.3 18.42,93.34 25.45,93.34 U$2.P$15
N$39
  Bottom 0.406: JP_TASTER.2 18.25,31.74 C_TASTER1.1 24.6,45.08 RN2.2 U$1.P$10 41.74,45.08 41.74,56.51 75.4,56.51 75.4,55.24 U$1.P$43
N$41
  Bottom 0.406: R3.2 93.18,77.47 IC3.16
N$42  (via drill 1)
  Top 0.813: v40.48,50.16 v44.28,50.16
  Bottom 0.406: IC2.8 72.86,53.97 44.28,53.97 v44.28,50.16 | U$1.P$8 v40.48,50.16
N$43
  Bottom 0.406: RN1.8 U$1.P$41
N$44
  Bottom 0.406: JP_KANAL_1.4 112.23,19.68 104.61,19.68 | 104.61,19.68 JP_KANAL_1.1 | 104.61,19.68 102.07,19.68 102.07,15.87 32.22,15.87 32.22,32.38 U$1.P$15
N$45
  Bottom 0.406: RN1.9 U$1.P$42
N$46
  Bottom 0.406: IC3.1 93.18,66.67 104.61,66.67 R4.1
N$47
  Bottom 0.406: U$2.P$1 33.91,75.56 R5.2
N$48  (via drill 1)
  Top 0.813: v47.46,52.7 v47.46,63.18
  Bottom 0.406: v47.46,63.18 47.46,69.21 46.19,69.21 R5.1 | v47.46,52.7 47.46,47.62 52.54,47.62 52.54,41.27 61.43,32.38 61.43,26.03 | 61.43,26.03 61.43,25.39 | U$1.P$27 65.24,24.12 61.43,24.12 61.43,26.03
N$49  (via drill 1)
  Top 0.813: v45.55,52.7 v45.55,63.18
  Bottom 0.406: v45.55,52.7 45.55,46.35 51.27,46.35 51.27,40 58.89,32.38 58.89,22.22 67.78,22.22 U$1.P$28 | v45.55,63.18 43.65,63.18 43.65,79.37 R2.1
N$50
  Bottom 0.406: JP_TASTER.6 24.6,24.76 | 24.6,24.76 C_TASTER3.2 | 24.6,24.76 27.14,24.76 27.14,40 RN2.4 U$1.P$12
N$51
  Bottom 0.406: U$2.P$5 31.3,79.37 R2.2
N$52
  Bottom 0.406: JP_TASTER.4 24.6,27.3 | 24.6,27.3 C_TASTER2.1 | 24.6,27.3 25.87,27.3 25.87,42.54 RN2.3 U$1.P$11
N$53
  Bottom 0.406: JP_TASTER.8 24.6,22.22 | 24.6,22.22 C_TASTER4.2 | 24.6,22.22 28.41,22.22 28.41,37.46 30.95,37.46 RN2.5 U$1.P$13
N$54
  Bottom 0.406: U$2.P$17 26.75,92.07 C_USB3.3V.1
N$55  (via drill 1)
  Top 0.813: v78.26,57.78 v78.26,66.67
  Bottom 0.406: JP_DISPLAY.7 95.72,88.26 88.1,88.26 88.1,83.18 81.75,83.18 81.75,70.48 84.29,70.48 84.29,66.67 v78.26,66.67 | v78.26,57.78 U$1.P$44
N$56
  Bottom 0.61: 16.98,52.7 19.52,52.7
N$57
  Bottom 0.61: 18.25,51.43 18.25,53.97
N$58
  Bottom 0.61: 18.25,37.46 18.25,40
N$59  (via drill 3.2)
  other vias: 118.58,99.69
N$60  (via drill 3.2)
  other vias: 118.58,9.52
N$61  (via drill 3.2)
  other vias: 9.36,9.52
N$62  (via drill 3.2)
  other vias: 9.36,99.69
N$63
  Bottom 0.406: U$1.P$62 44.92,67.94 C_AREF.1

### Text on the board
Bottom: Fader | Display | USB | DMX | K6 | Vcc | K5 | K4 | K3 | Taster | PvP | K2 | K1 | 26. Mai 2009 | V 1.0.4 | Steuerplatine | Peter Weissig